# Altium schematic sheet DSO_Control.SchDoc: Schematic_Name
size A4; CompanyName: University of Melbourne; Engineer: Your Name Here; DocumentNumber: 1; Revision: 0.1; SheetNumber: 1; SheetTotal: 1; Title_Project: Project_Title; StudentNo: Student No.
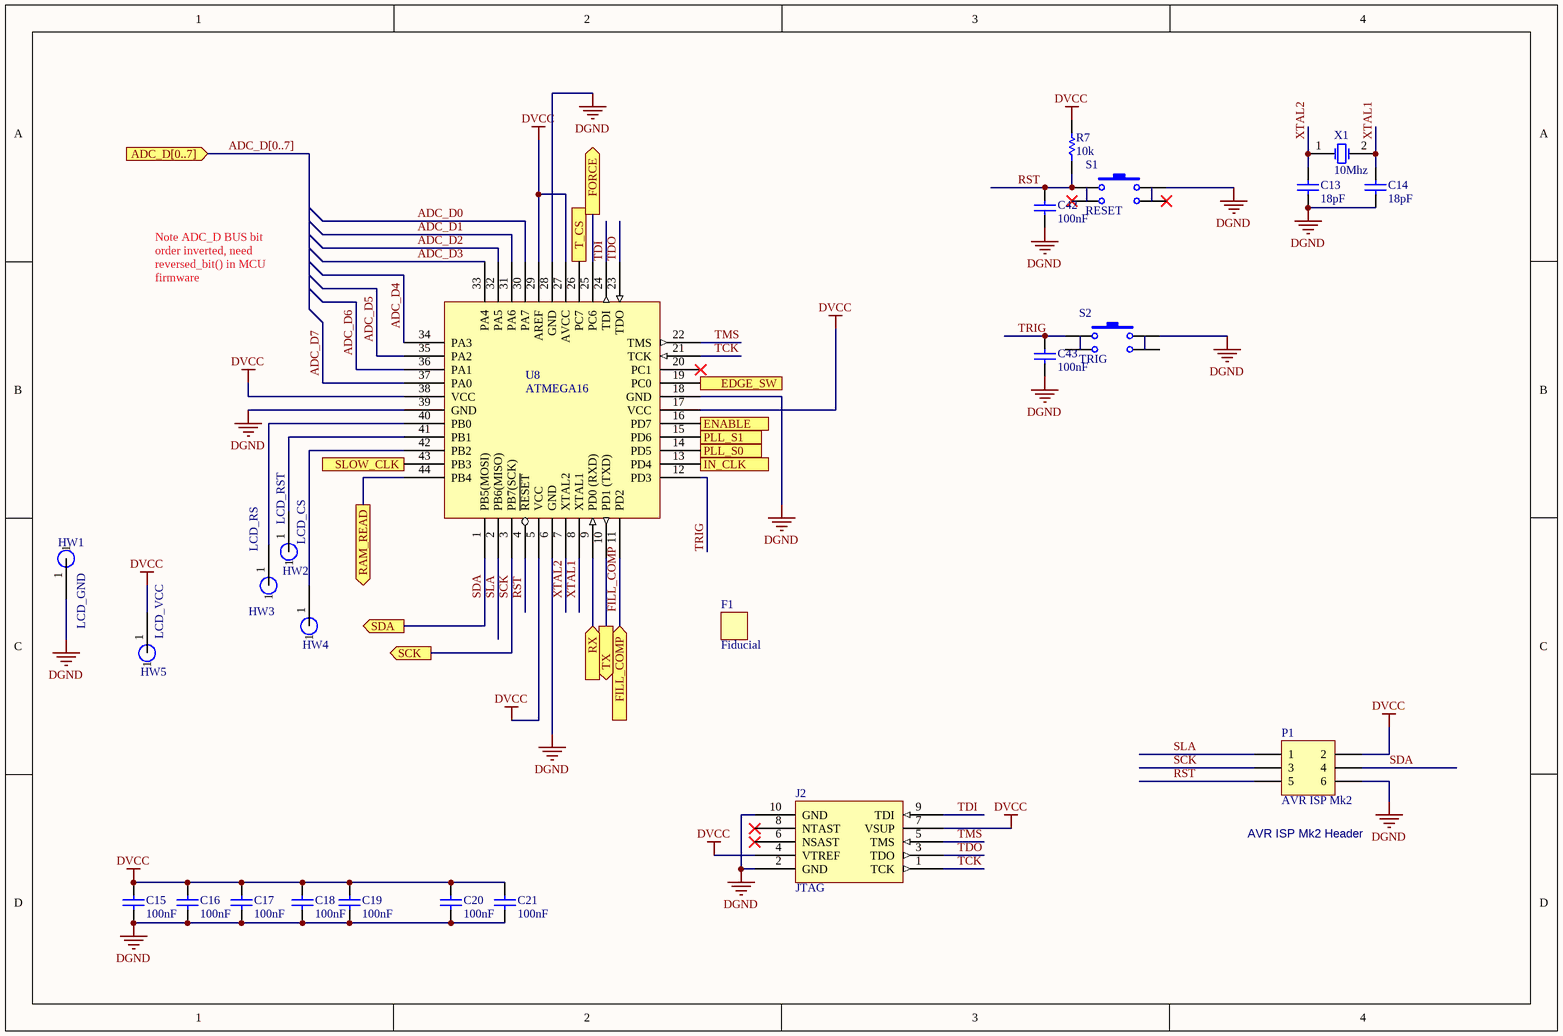
[diagram p0: DSO_Control.SchDoc]

## Parts
C13  18pF  [0805C]
C14  18pF  [0805C]
C15  100nF  [0805C]
C16  100nF  [0805C]
C17  100nF  [0805C]
C18  100nF  [0805C]
C19  100nF  [0805C]
C20  100nF  [0805C]
C21  100nF  [0805C]
C42  100nF  [0805C]
C43  100nF  [0805C]
F1  Fiducial  [Fiducial]  (no BOM)
HW1  LCD_GND  [HOLE_FOR_WIRE]  (no BOM)
HW2  LCD_RST  [HOLE_FOR_WIRE]  (no BOM)
HW3  LCD_RS  [HOLE_FOR_WIRE]  (no BOM)
HW4  LCD_CS  [HOLE_FOR_WIRE]  (no BOM)
HW5  LCD_VCC  [HOLE_FOR_WIRE]  (no BOM)
J2  JTAG  [BOXEDVERT10]
P1  AVR ISP Mk2  [HDR3x2]
R7  10k  [0805]
S1  RESET  [SPST PB SWITCH SMD]
S2  TRIG  [SPST PB SWITCH SMD]
U8  ATMEGA16  [QFP-48]
X1  10Mhz  [XTAL_FLAT_SMD]

## Ports
ADC_D[0..7] (in), EDGE_SW (out), ENABLE (out), FILL_COMP (in), FORCE (out), IN_CLK (out), PLL_S0 (out), PLL_S1 (out), RAM_READ (out), RX (in), SCK (out), SDA (out), SLOW_CLK (out), T_CS (out), TX (out)

## Nets
DGND: C13.2 C14.2 C15.2 C16.2 C17.2 C18.2 C19.2 C20.2 C21.2 C42.2 C43.2 HW1.1 J2.2(GND) J2.10(GND) P1.6 S1.2 S2.2 U8.6(GND) U8.18(GND) U8.28(GND) U8.39(GND)
DVCC: C15.1 C16.1 C17.1 C18.1 C19.1 C20.1 C21.1 HW5.1 J2.4(VTREF) J2.7(VSUP) P1.2 R7.2 U8.5(VCC) U8.17(VCC) U8.27(AVCC) U8.29(AREF) U8.38(VCC)
ADC_D0: U8.30(PA7)
ADC_D1: U8.31(PA6)
ADC_D2: U8.32(PA5)
ADC_D3: U8.33(PA4)
ADC_D4: U8.34(PA3)
ADC_D5: U8.35(PA2)
ADC_D6: U8.36(PA1)
ADC_D7: U8.37(PA0)
EDGE_SW: U8.19(PC0) ; port EDGE_SW
ENABLE: U8.16(PD7) ; port ENABLE
FILL_COMP: U8.11(PD2) ; port FILL_COMP
FORCE: U8.25(PC6) ; port FORCE
IN_CLK: U8.13(PD4) ; port IN_CLK
PLL_S0: U8.14(PD5) ; port PLL_S0
PLL_S1: U8.15(PD6) ; port PLL_S1
RAM_READ: U8.44(PB4) ; port RAM_READ
RST: C42.1 P1.5 R7.1 S1.1 U8.4(~{RESET})
RX: U8.9(PD0_(RXD)) ; port RX
SCK: P1.3 U8.3(PB7(SCK)) ; port SCK
SDA: P1.4 U8.1(PB5(MOSI)) ; port SDA
SLA: P1.1 U8.2(PB6(MISO))
SLOW_CLK: U8.43(PB3) ; port SLOW_CLK
T_CS: U8.26(PC7) ; port T_CS
TCK: J2.1(TCK) U8.21(TCK)
TDI: J2.9(TDI) U8.24(TDI)
TDO: J2.3(TDO) U8.23(TDO)
TMS: J2.5(TMS) U8.22(TMS)
TRIG: C43.1 S2.1 U8.12(PD3)
TX: U8.10(PD1_(TXD)) ; port TX
XTAL1: C14.1 U8.8(XTAL1) X1.2(OSC2)
XTAL2: C13.1 U8.7(XTAL2) X1.1(OSC1)
NetHW2_1: HW2.1 U8.41(PB1)
NetHW3_1: HW3.1 U8.40(PB0)
NetHW4_1: HW4.1 U8.42(PB2)

Not connected (* = marked no-connect by the designer): J2 6(NSAST)* 8(NTAST)*; S1 3* 4*; S2 3 4; U8 20(PC1)*

## Buses and harness runs
bus ADC_D[0..7] = port ADC_D[0..7]

## Notes on the sheet
- Note ADC_D BUS bit order inverted, need reversed_bit() in MCU firmware
- (near P1) AVR ISP Mk2 Header

## Library data of the parts
C13-C21 C42 C43 = C: Capacitor; Reviewed by: RM - 2018/08/05; Revision: July-2002: Re-released for DXP Platform.; Supplier 1: *; Supplier Part Number 1: *
  C13 C14: Value: 18pF
  C15-C21 C42 C43: Value: 100nF
HW1-HW5 = HOLE_FOR_WIRE: Hole for wire
J2 = JTAG_CON: Reviewed by: RM - 2018/08/05; Supplier 1: Digi-Key; Supplier Part Number 1: OR896-ND
P1 = Header 3x2: Header, 5-Pin; Reviewed by: RM - 2018/08/05; Supplier 1: Digi-Key; Supplier Part Number 1: 952-2121-ND
R7 = R: Resistor; Reviewed by: RM - 2018/08/05; Value: 10k; Supplier 1: *; Suppler Part Number 1: *
S1 S2 = SW_PB_1P1T4: Momentary Push Button Switch 1P 1T 2pins; Reviewed by: RM - 2018/08/05; Revision: July-2002: Re-released for DXP Platform.; Supplier 1: Digi-Key; Supplier Part Number 1: CKN9085CT-ND
U8 = ATMEGA16: ATMEGA16 Microcontroller; Reviewed by: RM - 2018/08/05; Supplier 1: Digi-Key; Supplier Part Number 1: ATMEGA16A-AU-ND
X1 = XTAL: Crystal Oscillator; Reviewed by: RM - 2018/08/05; Revision: July-2002: Re-released for DXP Platform.; Supplier 1: Digi-Key; Supplier Part Number 1: 887-1080-1-ND